# EAGLE design VoltgeMonitors_(TPS3839x) (EAGLE 7.1.0)
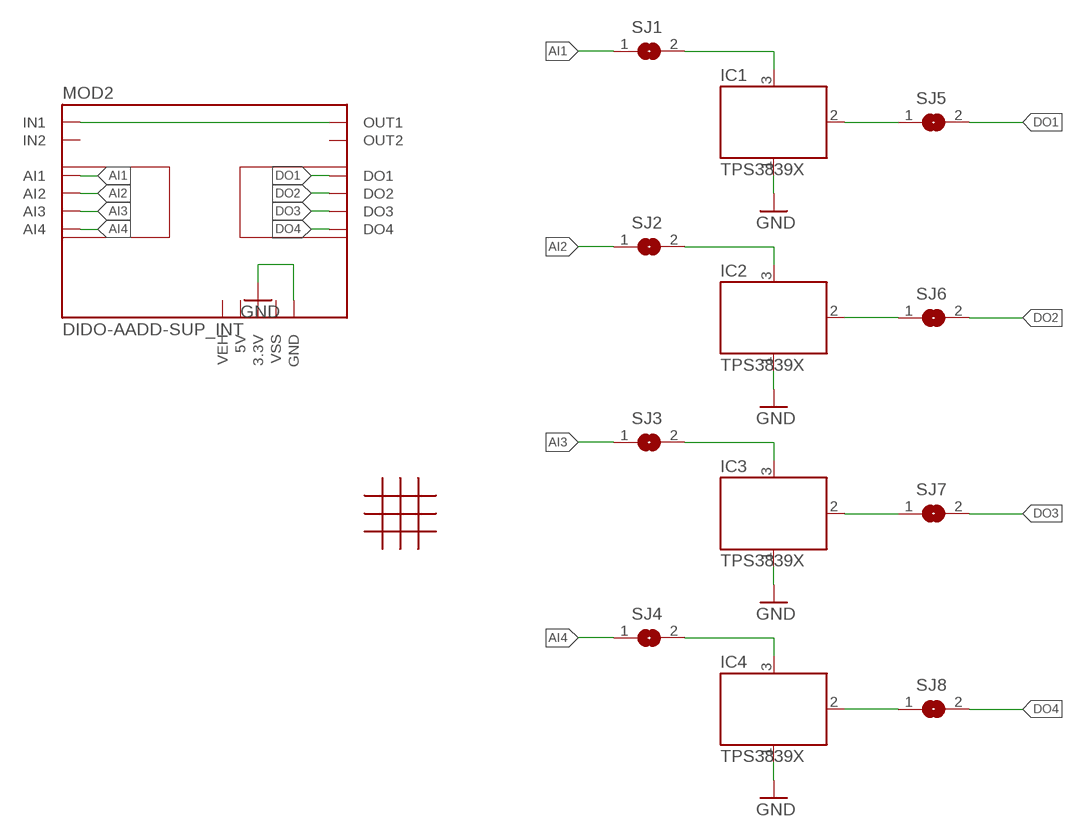
[diagram p0: schematic, sheet 1]

## Parts
IC1  TPS3839X  [DBZ_R-PDSO-G3]
IC2  TPS3839X  [DBZ_R-PDSO-G3]
IC3  TPS3839X  [DBZ_R-PDSO-G3]
IC4  TPS3839X  [DBZ_R-PDSO-G3]
MOD2  DIDO-AADD-SUP_INT  [DIDO-AADD-SUP]
SJ1  SJ2  [SJ2]
SJ2  SJ2  [SJ2]
SJ3  SJ2  [SJ2]
SJ4  SJ2  [SJ2]
SJ5  SJ2  [SJ2]
SJ6  SJ2  [SJ2]
SJ7  SJ2  [SJ2]
SJ8  SJ2  [SJ2]
U$1  SMD  [SMD-PROTOTYPE]

## Nets
AI1: MOD2.AI1 SJ1.1
AI2: MOD2.AI2 SJ2.1
AI3: MOD2.AI3 SJ3.1
AI4: MOD2.AI4 SJ4.1
DO1: MOD2.DO1 SJ5.2
DO2: MOD2.DO2 SJ6.2
DO3: MOD2.DO3 SJ7.2
DO4: MOD2.DO4 SJ8.2
GND: IC1.1(GND) IC2.1(GND) IC3.1(GND) IC4.1(GND) MOD2.GND1(GND) MOD2.GND2(GND) MOD2.GND3(GND) MOD2.GND4(GND)
IN: MOD2.IN1 MOD2.IN2(IN1) MOD2.IN3(IN1) MOD2.IN4(IN1) MOD2.OUT1 MOD2.OUT2(OUT1) MOD2.OUT3(OUT1) MOD2.OUT4(OUT1)
N$1: IC1.3(VDD) SJ1.2
N$2: IC2.3(VDD) SJ2.2
N$3: IC3.3(VDD) SJ3.2
N$4: IC4.3(VDD) SJ4.2
N$5: IC4.2(/RST) SJ8.1
N$6: IC3.2(/RST) SJ7.1
N$7: IC2.2(/RST) SJ6.1
N$8: IC1.2(/RST) SJ5.1
Unconnected: MOD2.IN2_1(IN2) MOD2.IN2_2(IN2) MOD2.IN2_3(IN2) MOD2.IN2_4(IN2) MOD2.OUT2_1(OUT2) MOD2.OUT2_2(OUT2) MOD2.OUT2_3(OUT2) MOD2.OUT2_4(OUT2)

## Power pins joined to a net without a drawn wire
3.3V: MOD2.3.3V
5V: MOD2.5V
VEH: MOD2.VEH
VSS: MOD2.VSS

## Library data of the parts
IC1-IC4 = TPS3839x:TPS3839X
MOD2 = AllModules:DIDO-AADD-SUP_INT
SJ1-SJ8 = Jumper_mod:SJ2: SMD solder JUMPER
U$1 = SMD-Prototype:SMD

## Board
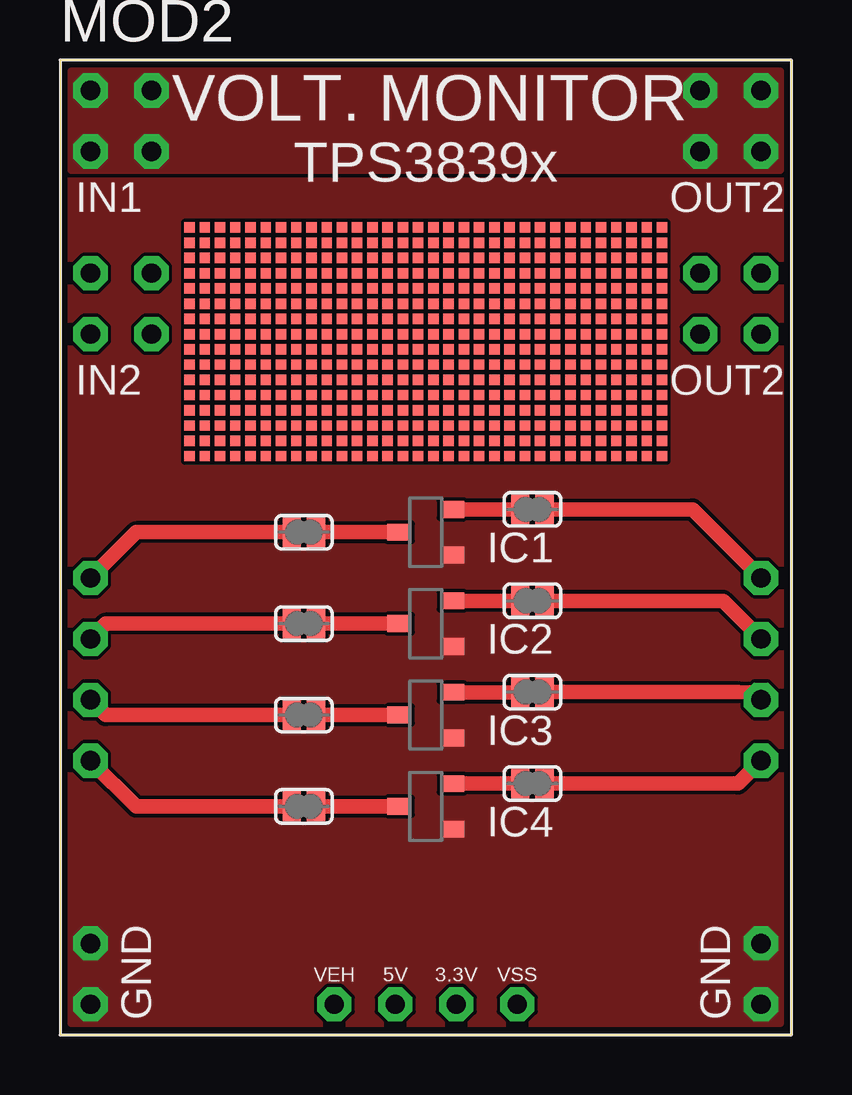
[diagram p1: board, top side]
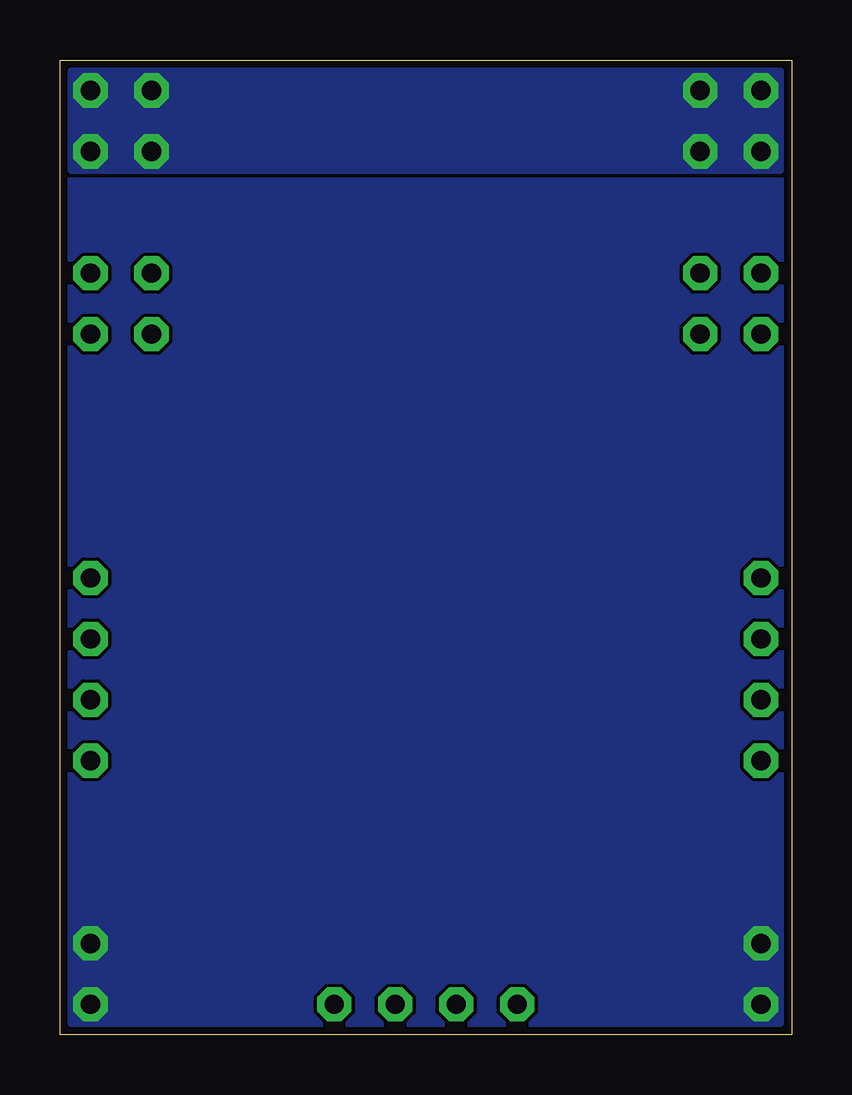
[diagram p2: board, bottom side, seen from below]

Size 30.48 x 40.64 mm. Coordinates in mm from the lower left corner, seen from the top.
Outline: 0,0 30.48,0 30.48,40.64 0,40.64 0,0
Copper layers (1*16): Top 0.035mm / dielectric 1.5mm / Bottom 0.035mm
Design rules "PCB-POOL Standard": minimum track width 0.15mm, minimum drill 0.3mm, track to track 0.15mm, track to pad 0.15mm, pad to pad 0.15mm, via to via 0.15mm, smd to smd 0.15mm, copper to edge 0.3mm, drill to drill 0.2mm, minimum pad ring 0.2mm, minimum via ring 0.15mm, stop-mask expansion 0.075mm, vias tented up to drill 0mil, thermal gap 0.2mm

### Footprints (pad centres in the part's own frame; a part is rotated, then mirrored left to right if it is on the bottom)
DBZ_R-PDSO-G3 = smd 0.7 x 1: 1 -0.95,-1.1; 2 0.95,-1.1; 3 0,1.1
DIDO-AADD-SUP = drill 0.8 pad 1.422 octagon: 3.3V 15.24,-38.1; 5V 12.7,-38.1; AI1 0,-20.32; AI2 0,-22.86; AI3 0,-25.4; AI4 0,-27.94; DO1 27.94,-20.32; DO2 27.94,-22.86; DO3 27.94,-25.4; DO4 27.94,-27.94; GND1 0,-38.1; GND2 0,-35.56; GND3 27.94,-35.56; GND4 27.94,-38.1; IN1 0,0; IN2 0,-2.54; IN2_1 0,-7.62; IN2_2 0,-10.16; IN2_3 2.54,-7.62; IN2_4 2.54,-10.16; IN3 2.54,0; IN4 2.54,-2.54; OUT1 25.4,0; OUT2 25.4,-2.54; OUT2_1 25.4,-7.62; OUT2_2 25.4,-10.16; OUT2_3 27.94,-7.62; OUT2_4 27.94,-10.16; OUT3 27.94,0; OUT4 27.94,-2.54; VEH 10.16,-38.1; VSS 17.78,-38.1
SJ2 = smd 0.762 x 1.27: 1 -0.508,0; 2 0.508,0
SMD-PROTOTYPE = smd 0.432 x 0.432: P$1 0,0; P$2 0,0.635; P$3 0,1.27; P$4 0,1.905; P$5 0,2.54; P$6 0,3.175; P$7 0,3.81; P$8 0,4.445; P$9 0,5.08; P$10 0,5.715; P$11 0,6.35; P$12 0,6.985; P$13 0.635,0; P$14 0.635,0.635; P$15 0.635,1.27; P$16 0.635,1.905; P$17 0.635,2.54; P$18 0.635,3.175; P$19 0.635,3.81; P$20 0.635,4.445; P$21 0.635,5.08; P$22 0.635,5.715; P$23 0.635,6.35; P$24 0.635,6.985; P$25 1.27,0; P$26 1.27,0.635; P$27 1.27,1.27; P$28 1.27,1.905; P$29 1.27,2.54; P$30 1.27,3.175; P$31 1.27,3.81; P$32 1.27,4.445; P$33 1.27,5.08; P$34 1.27,5.715; P$35 1.27,6.35; P$36 1.27,6.985; P$37 1.905,0; P$38 1.905,0.635; P$39 1.905,1.27; P$40 1.905,1.905; P$41 1.905,2.54; P$42 1.905,3.175; P$43 1.905,3.81; P$44 1.905,4.445; P$45 1.905,5.08; P$46 1.905,5.715; P$47 1.905,6.35; P$48 1.905,6.985; P$49 2.54,0; P$50 2.54,0.635; P$51 2.54,1.27; P$52 2.54,1.905; P$53 2.54,2.54; P$54 2.54,3.175; P$55 2.54,3.81; P$56 2.54,4.445; P$57 2.54,5.08; P$58 2.54,5.715; P$59 2.54,6.35; P$60 2.54,6.985; P$61 3.175,0; P$62 3.175,0.635; P$63 3.175,1.27; P$64 3.175,1.905; P$65 3.175,2.54; P$66 3.175,3.175; P$67 3.175,3.81; P$68 3.175,4.445; P$69 3.175,5.08; P$70 3.175,5.715; P$71 3.175,6.35; P$72 3.175,6.985; P$73 3.81,0; P$74 3.81,0.635; P$75 3.81,1.27; P$76 3.81,1.905; P$77 3.81,2.54; P$78 3.81,3.175; P$79 3.81,3.81; P$80 3.81,4.445; P$81 3.81,5.08; P$82 3.81,5.715; P$83 3.81,6.35; P$84 3.81,6.985; P$85 4.445,0; P$86 4.445,0.635; P$87 4.445,1.27; P$88 4.445,1.905; P$89 4.445,2.54; P$90 4.445,3.175; P$91 4.445,3.81; P$92 4.445,4.445; P$93 4.445,5.08; P$94 4.445,5.715; P$95 4.445,6.35; P$96 4.445,6.985; P$97 5.08,0; P$98 5.08,0.635; P$99 5.08,1.27; P$100 5.08,1.905; P$101 5.08,2.54; P$102 5.08,3.175; P$103 5.08,3.81; P$104 5.08,4.445; P$105 5.08,5.08; P$106 5.08,5.715; P$107 5.08,6.35; P$108 5.08,6.985; P$109 5.715,0; P$110 5.715,0.635; P$111 5.715,1.27; P$112 5.715,1.905; P$113 5.715,2.54; P$114 5.715,3.175; P$115 5.715,3.81; P$116 5.715,4.445; P$117 5.715,5.08; P$118 5.715,5.715; P$119 5.715,6.35; P$120 5.715,6.985; P$121 6.35,0; P$122 6.35,0.635; P$123 6.35,1.27; P$124 6.35,1.905; P$125 6.35,2.54; P$126 6.35,3.175; P$127 6.35,3.81; P$128 6.35,4.445; P$129 6.35,5.08; P$130 6.35,5.715; P$131 6.35,6.35; P$132 6.35,6.985; P$133 6.985,0; P$134 6.985,0.635; P$135 6.985,1.27; P$136 6.985,1.905; P$137 6.985,2.54; P$138 6.985,3.175; P$139 6.985,3.81; P$140 6.985,4.445; P$141 6.985,5.08; P$142 6.985,5.715; P$143 6.985,6.35; P$144 6.985,6.985; P$145 7.62,0; P$146 7.62,0.635; P$147 7.62,1.27; P$148 7.62,1.905; P$149 7.62,2.54; P$150 7.62,3.175; P$151 7.62,3.81; P$152 7.62,4.445; P$153 7.62,5.08; P$154 7.62,5.715; P$155 7.62,6.35; P$156 7.62,6.985; P$157 8.255,0; P$158 8.255,0.635; P$159 8.255,1.27; P$160 8.255,1.905; P$161 8.255,2.54; P$162 8.255,3.175; P$163 8.255,3.81; P$164 8.255,4.445; P$165 8.255,5.08; P$166 8.255,5.715; P$167 8.255,6.35; P$168 8.255,6.985; P$169 8.89,0; P$170 8.89,0.635; P$171 8.89,1.27; P$172 8.89,1.905; P$173 8.89,2.54; P$174 8.89,3.175; P$175 8.89,3.81; P$176 8.89,4.445; P$177 8.89,5.08; P$178 8.89,5.715; P$179 8.89,6.35; P$180 8.89,6.985; P$181 9.525,0; P$182 9.525,0.635; P$183 9.525,1.27; P$184 9.525,1.905; P$185 9.525,2.54; P$186 9.525,3.175; P$187 9.525,3.81; P$188 9.525,4.445; P$189 9.525,5.08; P$190 9.525,5.715; P$191 9.525,6.35; P$192 9.525,6.985; P$193 10.16,0; P$194 10.16,0.635; P$195 10.16,1.27; P$196 10.16,1.905; P$197 10.16,2.54; P$198 10.16,3.175; P$199 10.16,3.81; P$200 10.16,4.445; P$201 10.16,5.08; P$202 10.16,5.715; P$203 10.16,6.35; P$204 10.16,6.985; P$205 10.795,0; P$206 10.795,0.635; P$207 10.795,1.27; P$208 10.795,1.905; P$209 10.795,2.54; P$210 10.795,3.175; P$211 10.795,3.81; P$212 10.795,4.445; P$213 10.795,5.08; P$214 10.795,5.715; P$215 10.795,6.35; P$216 10.795,6.985; P$217 11.43,0; P$218 11.43,0.635; P$219 11.43,1.27; P$220 11.43,1.905; P$221 11.43,2.54; P$222 11.43,3.175; P$223 11.43,3.81; P$224 11.43,4.445; P$225 11.43,5.08; P$226 11.43,5.715; P$227 11.43,6.35; P$228 11.43,6.985; P$229 12.065,0; P$230 12.065,0.635; P$231 12.065,1.27; P$232 12.065,1.905; P$233 12.065,2.54; P$234 12.065,3.175; P$235 12.065,3.81; P$236 12.065,4.445; P$237 12.065,5.08; P$238 12.065,5.715; P$239 12.065,6.35; P$240 12.065,6.985; P$241 12.7,0; P$242 12.7,0.635; P$243 12.7,1.27; P$244 12.7,1.905; P$245 12.7,2.54; P$246 12.7,3.175; P$247 12.7,3.81; P$248 12.7,4.445; P$249 12.7,5.08; P$250 12.7,5.715; P$251 12.7,6.35; P$252 12.7,6.985; P$253 13.335,0; P$254 13.335,0.635; P$255 13.335,1.27; P$256 13.335,1.905; P$257 13.335,2.54; P$258 13.335,3.175; P$259 13.335,3.81; P$260 13.335,4.445; P$261 13.335,5.08; P$262 13.335,5.715; P$263 13.335,6.35; P$264 13.335,6.985; P$265 13.97,0; P$266 13.97,0.635; P$267 13.97,1.27; P$268 13.97,1.905; P$269 13.97,2.54; P$270 13.97,3.175; P$271 13.97,3.81; P$272 13.97,4.445; P$273 13.97,5.08; P$274 13.97,5.715; P$275 13.97,6.35; P$276 13.97,6.985; P$277 14.605,0; P$278 14.605,0.635; P$279 14.605,1.27; P$280 14.605,1.905; P$281 14.605,2.54; P$282 14.605,3.175; P$283 14.605,3.81; P$284 14.605,4.445; P$285 14.605,5.08; P$286 14.605,5.715; P$287 14.605,6.35; P$288 14.605,6.985; P$289 15.24,0; P$290 15.24,0.635; P$291 15.24,1.27; P$292 15.24,1.905; P$293 15.24,2.54; P$294 15.24,3.175; P$295 15.24,3.81; P$296 15.24,4.445; P$297 15.24,5.08; P$298 15.24,5.715; P$299 15.24,6.35; P$300 15.24,6.985; P$301 15.875,0; P$302 15.875,0.635; P$303 15.875,1.27; P$304 15.875,1.905; P$305 15.875,2.54; P$306 15.875,3.175; P$307 15.875,3.81; P$308 15.875,4.445; P$309 15.875,5.08; P$310 15.875,5.715; P$311 15.875,6.35; P$312 15.875,6.985; P$313 16.51,0; P$314 16.51,0.635; P$315 16.51,1.27; P$316 16.51,1.905; P$317 16.51,2.54; P$318 16.51,3.175; P$319 16.51,3.81; P$320 16.51,4.445; P$321 16.51,5.08; P$322 16.51,5.715; P$323 16.51,6.35; P$324 16.51,6.985; P$325 17.145,0; P$326 17.145,0.635; P$327 17.145,1.27; P$328 17.145,1.905; P$329 17.145,2.54; P$330 17.145,3.175; P$331 17.145,3.81; P$332 17.145,4.445; P$333 17.145,5.08; P$334 17.145,5.715; P$335 17.145,6.35; P$336 17.145,6.985; P$337 17.78,0; P$338 17.78,0.635; P$339 17.78,1.27; P$340 17.78,1.905; P$341 17.78,2.54; P$342 17.78,3.175; P$343 17.78,3.81; P$344 17.78,4.445; P$345 17.78,5.08; P$346 17.78,5.715; P$347 17.78,6.35; P$348 17.78,6.985; P$349 18.415,0; P$350 18.415,0.635; P$351 18.415,1.27; P$352 18.415,1.905; P$353 18.415,2.54; P$354 18.415,3.175; P$355 18.415,3.81; P$356 18.415,4.445; P$357 18.415,5.08; P$358 18.415,5.715; P$359 18.415,6.35; P$360 18.415,6.985; P$361 19.05,0; P$362 19.05,0.635; P$363 19.05,1.27; P$364 19.05,1.905; P$365 19.05,2.54; P$366 19.05,3.175; P$367 19.05,3.81; P$368 19.05,4.445; P$369 19.05,5.08; P$370 19.05,5.715; P$371 19.05,6.35; P$372 19.05,6.985; P$373 19.685,0; P$374 19.685,0.635; P$375 19.685,1.27; P$376 19.685,1.905; P$377 19.685,2.54; P$378 19.685,3.175; P$379 19.685,3.81; P$380 19.685,4.445; P$381 19.685,5.08; P$382 19.685,5.715; P$383 19.685,6.35; P$384 19.685,6.985; P$385 0,7.62; P$386 0,8.255; P$387 0,8.89; P$388 0,9.525; P$389 0.635,7.62; P$390 0.635,8.255; P$391 0.635,8.89; P$392 0.635,9.525; P$393 1.27,7.62; P$394 1.27,8.255; P$395 1.27,8.89; P$396 1.27,9.525; P$397 1.905,7.62; P$398 1.905,8.255; P$399 1.905,8.89; P$400 1.905,9.525; P$401 2.54,7.62; P$402 2.54,8.255; P$403 2.54,8.89; P$404 2.54,9.525; P$405 3.175,7.62; P$406 3.175,8.255; P$407 3.175,8.89; P$408 3.175,9.525; P$409 3.81,7.62; P$410 3.81,8.255; P$411 3.81,8.89; P$412 3.81,9.525; P$413 4.445,7.62; P$414 4.445,8.255; P$415 4.445,8.89; P$416 4.445,9.525; P$417 5.08,7.62; P$418 5.08,8.255; P$419 5.08,8.89; P$420 5.08,9.525; P$421 5.715,7.62; P$422 5.715,8.255; P$423 5.715,8.89; P$424 5.715,9.525; P$425 6.35,7.62; P$426 6.35,8.255; P$427 6.35,8.89; P$428 6.35,9.525; P$429 6.985,7.62; P$430 6.985,8.255; P$431 6.985,8.89; P$432 6.985,9.525; P$433 7.62,7.62; P$434 7.62,8.255; P$435 7.62,8.89; P$436 7.62,9.525; P$437 8.255,7.62; P$438 8.255,8.255; P$439 8.255,8.89; P$440 8.255,9.525; P$441 8.89,7.62; P$442 8.89,8.255; P$443 8.89,8.89; P$444 8.89,9.525; P$445 9.525,7.62; P$446 9.525,8.255; P$447 9.525,8.89; P$448 9.525,9.525; P$449 10.16,7.62; P$450 10.16,8.255; P$451 10.16,8.89; P$452 10.16,9.525; P$453 10.795,7.62; P$454 10.795,8.255; P$455 10.795,8.89; P$456 10.795,9.525; P$457 11.43,7.62; P$458 11.43,8.255; P$459 11.43,8.89; P$460 11.43,9.525; P$461 12.065,7.62; P$462 12.065,8.255; P$463 12.065,8.89; P$464 12.065,9.525; P$465 12.7,7.62; P$466 12.7,8.255; P$467 12.7,8.89; P$468 12.7,9.525; P$469 13.335,7.62; P$470 13.335,8.255; P$471 13.335,8.89; P$472 13.335,9.525; P$473 13.97,7.62; P$474 13.97,8.255; P$475 13.97,8.89; P$476 13.97,9.525; P$477 14.605,7.62; P$478 14.605,8.255; P$479 14.605,8.89; P$480 14.605,9.525; P$481 15.24,7.62; P$482 15.24,8.255; P$483 15.24,8.89; P$484 15.24,9.525; P$485 15.875,7.62; P$486 15.875,8.255; P$487 15.875,8.89; P$488 15.875,9.525; P$489 16.51,7.62; P$490 16.51,8.255; P$491 16.51,8.89; P$492 16.51,9.525; P$493 17.145,7.62; P$494 17.145,8.255; P$495 17.145,8.89; P$496 17.145,9.525; P$497 17.78,7.62; P$498 17.78,8.255; P$499 17.78,8.89; P$500 17.78,9.525; P$501 18.415,7.62; P$502 18.415,8.255; P$503 18.415,8.89; P$504 18.415,9.525; P$505 19.05,7.62; P$506 19.05,8.255; P$507 19.05,8.89; P$508 19.05,9.525; P$509 19.685,7.62; P$510 19.685,8.255; P$511 19.685,8.89; P$512 19.685,9.525

### Placement (x,y rotation side)
IC1  15.24,20.96 90 top
IC2  15.24,17.14 90 top
IC3  15.24,13.34 90 top
IC4  15.24,9.53 90 top
MOD2  1.27,39.37 0 top
SJ1  10.16,20.96 0 top
SJ2  10.16,17.14 0 top
SJ3  10.16,13.34 0 top
SJ4  10.16,9.53 0 top
SJ5  19.68,21.91 0 top
SJ6  19.68,18.1 0 top
SJ7  19.68,14.29 0 top
SJ8  19.68,10.48 0 top
U$1  5.4,24.13 0 top

### Tracks (layer width: path | path; a pad name or v marks a point on that pad's centre or on a via)
AI1
  Top 0.61: MOD2.AI1 3.17,20.96 SJ1.1
AI2
  Top 0.61: MOD2.AI2 1.91,17.14 SJ2.1
AI3
  Top 0.61: MOD2.AI3 1.91,13.34 SJ3.1
AI4
  Top 0.61: MOD2.AI4 3.17,9.53 SJ4.1
DO1
  Top 0.61: MOD2.DO1 26.36,21.91 SJ5.2
DO2
  Top 0.61: MOD2.DO2 27.62,18.09 SJ6.2
DO3
  Top 0.61: MOD2.DO3 28.89,14.29 28.26,14.29 SJ7.2
DO4
  Top 0.61: MOD2.DO4 28.25,10.48 SJ8.2
GND
  pour Bottom (rank 2, no thermals): 0.48,40.16 30,40.16 30,0.48 0.48,0.48
  pour Top (rank 2, no thermals): 0.48,40.16 30,40.16 30,0.48 0.48,0.48
IN
  pour Bottom (no thermals): 0.48,40.16 30,40.16 30,36.04 0.48,36.04
  pour Top (no thermals): 0.64,40.16 30,40.16 30,36.04 0.48,36.04 0.48,40.16
N$1
  Top 0.61: SJ1.2 IC1.3
N$2
  Top 0.61: IC2.3 SJ2.2
N$3
  Top 0.61: SJ3.2 IC3.3
N$4
  Top 0.61: SJ4.2 IC4.3
N$5
  Top 0.61: SJ8.1 IC4.2
N$6
  Top 0.61: IC3.2 SJ7.1
N$7
  Top 0.61: SJ6.1 IC2.2
N$8
  Top 0.61: SJ5.1 IC1.2

### Text on the board
tNames: VOLT. MONITOR | TPS3839x
bStop: Beckedahl & Kokert / 16.06.2015